# EAGLE design OpenServoCAN_Encoder_Board_V_1_0_1 (EAGLE 9.6.2)
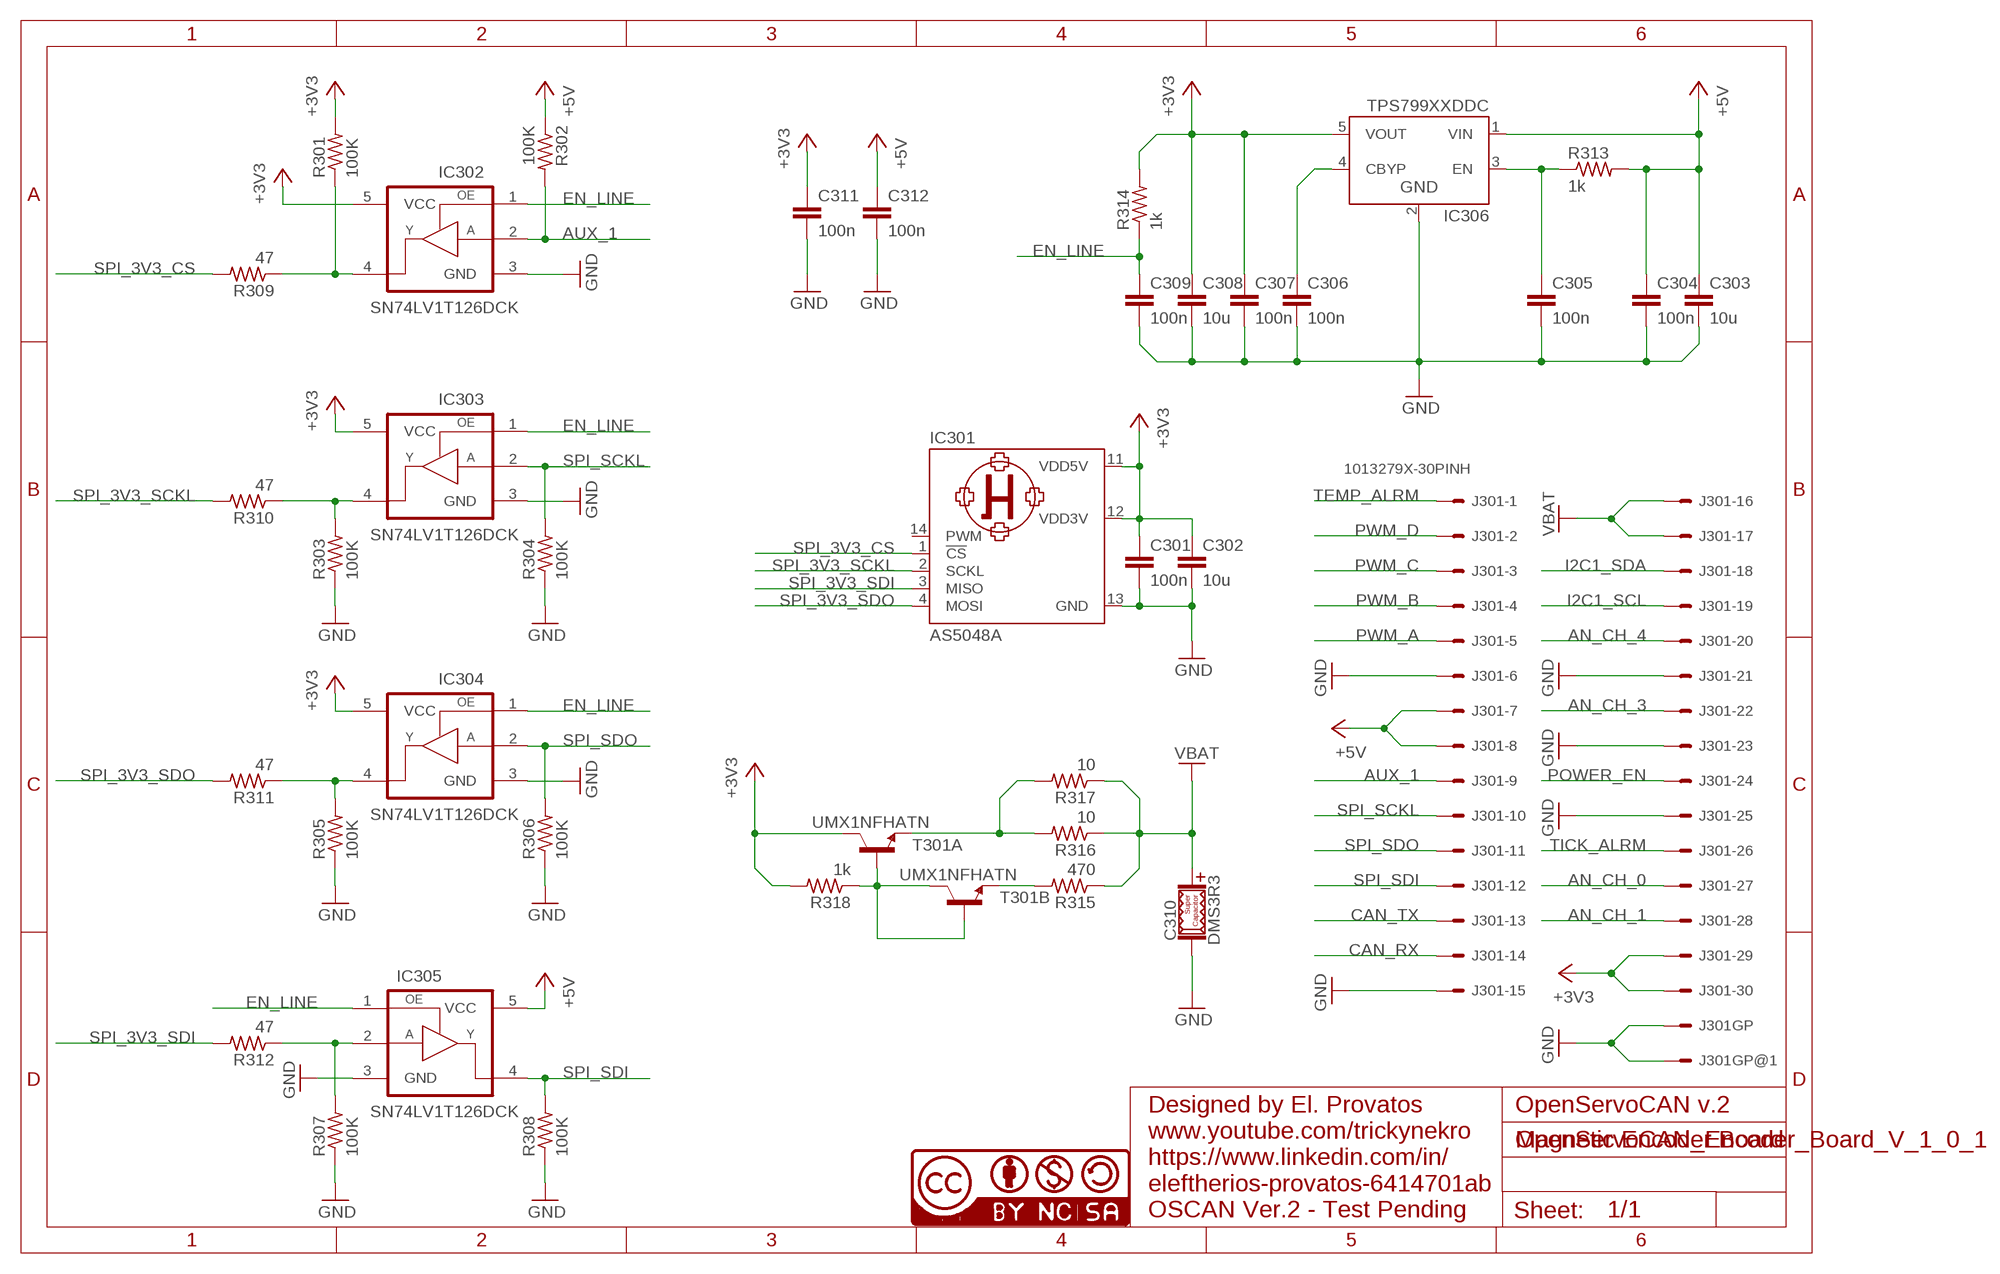
[diagram p0: schematic, sheet 1]

## Parts
C301  100n  C-EUC0402  [0402_C]
C302  10u  C-EUC0402  [0402_C]
C303  10u  C-EUC0402  [0402_C]
C304  100n  C-EUC0402  [0402_C]
C305  100n  C-EUC0402  [0402_C]
C306  100n  C-EUC0402  [0402_C]
C307  100n  C-EUC0402  [0402_C]
C308  10u  C-EUC0402  [0402_C]
C309  100n  C-EUC0402  [0402_C]
C310  DMS3R3  [DMS_3R3_S_CAP]
C311  100n  C-EUC0402  [0402_C]
C312  100n  C-EUC0402  [0402_C]
IC301  AS5048A  [TSSOP-14]
IC302  SN74LV1T126DCK  [SC-70-5]
IC303  SN74LV1T126DCK  [SC-70-5]
IC304  SN74LV1T126DCK  [SC-70-5]
IC305  SN74LV1T126DCK  [SC-70-5]
IC306  TPS799XXDDC  [SOT-23-5]
J301  1013279X-30PINH  [10132797-30]
R301  100K  R-USR0402  [0402_R]
R302  100K  R-USR0402  [0402_R]
R303  100K  R-USR0402  [0402_R]
R304  100K  R-USR0402  [0402_R]
R305  100K  R-USR0402  [0402_R]
R306  100K  R-USR0402  [0402_R]
R307  100K  R-USR0402  [0402_R]
R308  100K  R-USR0402  [0402_R]
R309  47  R-USR0402  [0402_R]
R310  47  R-USR0402  [0402_R]
R311  47  R-USR0402  [0402_R]
R312  47  R-USR0402  [0402_R]
R313  1k  R-USR0402  [0402_R]
R314  1k  R-USR0402  [0402_R]
R315  470  R-USR0402  [0402_R]
R316  10  R-USR0402  [0402_R]
R317  10  R-USR0402  [0402_R]
R318  1k  R-USR0402  [0402_R]
T301  UMX1NFHATN  [SC-70-6]
U$1  CC-NC-BCNIX  [CC-NC-B_NIX]

## Nets
+3V3: C301.1 C302.1 C307.1 C308.1 C311.1 IC301.11(VDD5V) IC301.12(VDD3V) IC302.5(VCC) IC303.5(VCC) IC304.5(VCC) IC306.5(VOUT) J301.29 J301.30 R301.2 R314.2 R318.2 T301.6(A:C)
+5V: C303.1 C304.1 C312.1 IC305.5(VCC) IC306.1(VIN) J301.7 J301.8 R302.1 R313.2
AN_CH_0: J301.27
AN_CH_1: J301.28
AN_CH_3: J301.22
AN_CH_4: J301.20
AUX_1: IC302.2(A) J301.9 R302.2
CAN_RX: J301.14
CAN_TX: J301.13
EN_LINE: C309.1 IC302.1(OE) IC303.1(OE) IC304.1(OE) IC305.1(OE) R314.1
GND: C301.2 C302.2 C303.2 C304.2 C305.2 C306.2 C307.2 C308.2 C309.2 C310.NEG-(NEG) C311.2 C312.2 IC301.13(GND) IC302.3(GND) IC303.3(GND) IC304.3(GND) IC305.3(GND) IC306.2(GND) J301.6 J301.15 J301.21 J301.23 J301.25 J301.EP@2 J301.EP@↑1 R303.1 R304.1 R305.1 R306.1 R307.1 R308.1
I2C1_SCL: J301.19
I2C1_SDA: J301.18
N$2: R318.1 T301.2(A:B) T301.3(B:C) T301.5(B:B)
N$4: C306.1 IC306.4(CBYP)
N$6: R316.2 R317.2 T301.1(A:E)
N$8: IC305.2(A) R307.2 R312.1
N$9: C305.1 IC306.3(EN) R313.1
N$10: IC304.4(Y) R305.2 R311.1
N$11: R315.2 T301.4(B:E)
N$12: IC303.4(Y) R303.2 R310.1
N$13: IC302.4(Y) R301.1 R309.1
POWER_EN: J301.24
PWM_A: J301.5
PWM_B: J301.4
PWM_C: J301.3
PWM_D: J301.2
SPI_3V3_CS: IC301.1(!CS) R309.2
SPI_3V3_SCKL: IC301.2(SCKL) R310.2
SPI_3V3_SDI: IC301.3(MISO) R312.2
SPI_3V3_SDO: IC301.4(MOSI) R311.2
SPI_SCKL: IC303.2(A) J301.10 R304.2
SPI_SDI: IC305.4(Y) J301.12 R308.2
SPI_SDO: IC304.2(A) J301.11 R306.2
TEMP_ALRM: J301.1
TICK_ALRM: J301.26
VBAT: C310.POS+(POS) J301.16 J301.17 R315.1 R316.1 R317.1
Unconnected: IC301.5(TEST) IC301.6(TEST) IC301.7(TEST) IC301.8(TEST) IC301.9(TEST) IC301.10(TEST) IC301.14(PWM)

## Notes on the sheet
- Designed by El. Provatos | OpenServoCAN v.2
- www.youtube.com/trickynekro
- Magnetic Encoder Board
- https://www.linkedin.com/in/
  eleftherios-provatos-6414701ab
- OSCAN Ver.2 - Test Pending

## Library data of the parts
C301-C309 C311 C312 = TRN_Open_Servo:C-EUC: Standard 0402 Capacitor with European Symbol
C310 = TRN_Open_Servo:DMS3R3: DMS 3R3 0.2 - 0.3 F @ 3V3 6.8X1.8 Coin Cell Super Capacitor
IC301 = TRN_Open_Servo:AS5048A: AS5048A The AS5048 is an easy to use 360° angle position sensor with a 14-bit high resolution output. The IC measures the absolute position of the magnet’s rotation angle and consists of Hall sensors, analog digital converter and digital signal processing. The absolute position information of the magnet is directly accessible over a PWM output and can be read out over a standard SPI or a high speed I²C interface. AS5048A has a SPI interface, AS5048B I²C interface. Both devices offer a PWM output. The zero position can be programmed via SPI or I²C command. This simplifies the assembly of the complete system because the zero position of the magnet does not need to be mechanically aligned. The sensor tolerates misalignment, air gap variations, temperature variations and as well external magnetic fields. This robustness and wide temperature range (-40°C up to 150°C) of the AS5048 makes the IC ideal for rotation angle sensing in harsh industrial and medical environments. Several AS5048 ICs can be connected in daisy chain for serial data read out. An internal voltage regulator allows the AS5048 to operate at either 3.3V or 5V supplies.
IC302-IC305 = TRN_Open_Servo:SN74LV1T126: SN74LV1T126 SN74LV1T126 is a low loltage CMOS gate logic that operates at a wider voltage range for industrial, portable, telecom, and automotive applications. The output level is referenced to the supply voltage and is able to support 1.8V/2.5V/3.3V/5V CMOS levels. The input is designed with a lower threshold circuit to match 1.8V input logic at VCC = 2.5V and can be used in 1.8V to 3.3V level up translation. In addition, the 5V tolerant input pins enable down translation (e.g. 3.3V to 2.5V output at VCC = 2.5V). The wide VCC range of 1.8V to 5.5V allows generation of desired output levels to connect to controllers or processors. The SN74LV1T126 is designed with current-drive capability of 8mA to reduce line reflections, overshoot, and undershoot caused by high-drive putputs.
IC306 = TRN_Open_Servo:TPS799XX: TPS799XX The TPS799 family of low-cost (LDO), low-power linear regulators offers excellent ac performance with very low ground currect. High power-supply rejection ration (PSRR), low noise, fast start-up, and excellent line and load transient response are provided while consuming a very low 40-μA (typical) ground current. The TPS799 is stable with ceramic capacitors and uses an advanced BiCMOS fabrication process to yield a dropout voltage of typically 100mV at a 200-mA output. The TPS799 uses a precision voltage reference and feedback loop to achieve an overall accuracy of 2% over all load, line, process, and temperature variations. The TPS799 features inrush current protection when the EN toggle is used to start the device, immediately clamping the current. All devices are fully specified over the temperature range of TJ = -10°C to 125°C, and offered in a low-profile, die-sided ball grid array (DSBGA) package, ideal for wireless handsets and WLAN cards. Link to Datasheet <https://www.ti.com/lit/ds/symlink/tps799.pdf?ts=1598828159184>
J301 = arm_project:1013279X-30PIN: Amphenol BergStak® 0.5mm Mezzanine Connector 20 Pin Variant Header / Receptacle
R301-R318 = TRN_Open_Servo:R-USR: Standard 0402 Resistor with American Symbol
T301 = TRN_Open_Servo:UMX1NFHA: UMX1NFHA General Purpose Transistor (Dual Transistors)
U$1 = cc-by-nc-sa:CC-NC-BC: All hardware is licensed under the Creative Commons Attribution-Noncommercial-Share Alike 2.5 Switzerland License. To view a copy of this license, visit http://creativecommons.org/licenses/by-nc-sa/2.5/ch/ or send a letter to Creative Commons, 171 Second Street, Suite 300, San Francisco, California, 94105, USA.

## Board
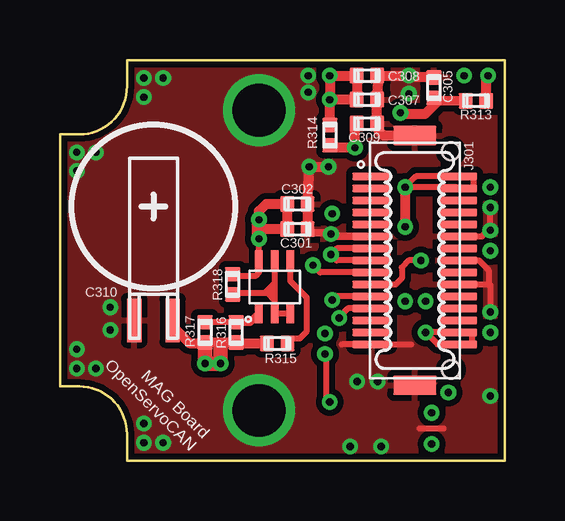
[diagram p1: board, top side]
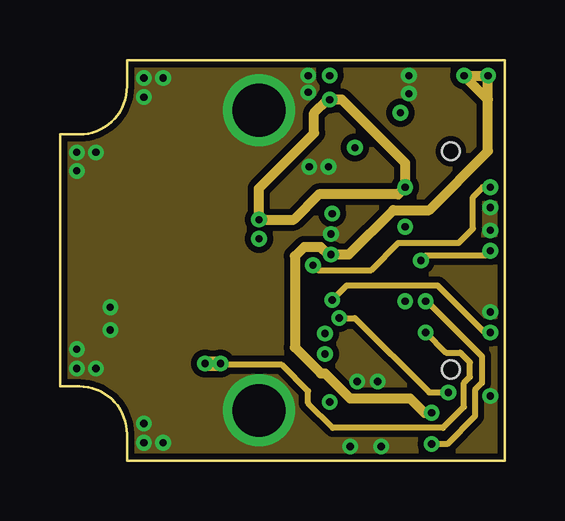
[diagram p2: board, inner layer Route2]
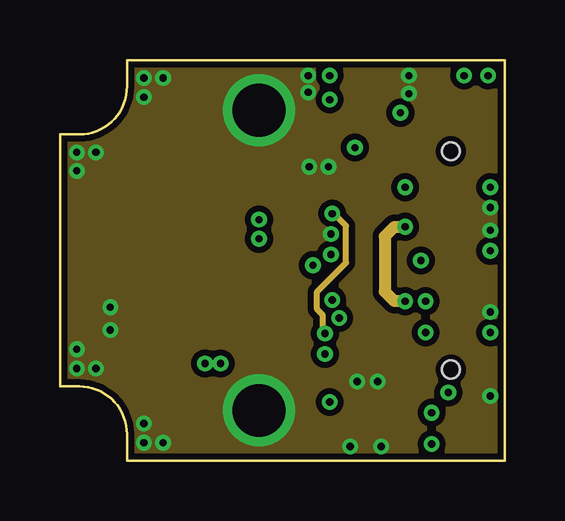
[diagram p3: board, inner layer Route15]
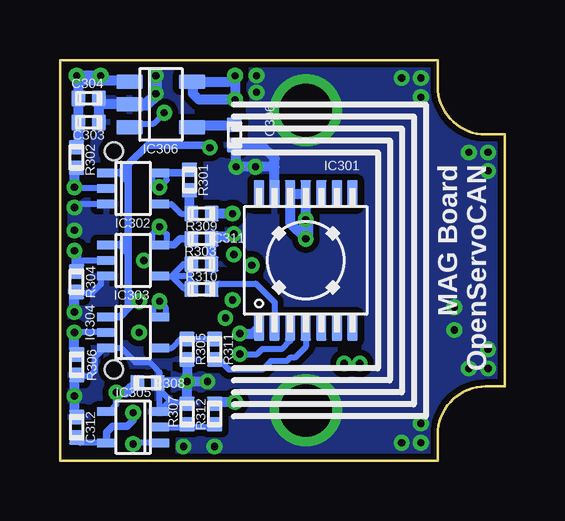
[diagram p4: board, bottom side, seen from below]

Size 18.55 x 16.7 mm. Coordinates in mm from the lower left corner, seen from the top.
Outline: 18.55,16.7 18.55,0 2.8,0 2.8,1.1 arc90 0.8,3.1 0,3.1 0,13.6 0.8,13.6 arc90 2.8,15.6 2.8,16.7 18.55,16.7
Copper layers (1+2*15+16): Top 0.018mm / dielectric 0.2mm / Route2 0.035mm / dielectric 0.36mm / Route15 0.035mm / dielectric 0.2mm / Bottom 0.018mm
Design rules "default *": minimum track width 6mil, minimum drill 0.3mm, track to track 6mil, track to pad 6mil, pad to pad 6mil, via to via 6mil, smd to smd 6mil, copper to edge 8mil, drill to drill 6mil, minimum pad ring 10mil, minimum via ring 5mil, stop-mask expansion 3mil, vias tented up to drill 15mil, thermal gap 10mil
tKeepout: area 6.3,12.6 to 10.3,16.6; area 6.3,0.1 to 10.3,4.1
bKeepout: area 6.3,12.6 to 10.3,16.6; area 6.3,0.1 to 10.3,4.1

### Footprints (pad centres in the part's own frame; a part is rotated, then mirrored left to right if it is on the bottom)
0402_C = smd 0.6 x 0.65: 1 -0.425,0; 2 0.425,0
DMS_3R3_S_CAP = smd 1.8 x 0.6: NEG- 4.75,-0.8; POS+ 4.75,0.8
TSSOP-14 = smd 1.15 x 0.45: 1 -2.775,1.95; 2 -2.775,1.3; 3 -2.775,0.65; 4 -2.775,0; 5 -2.775,-0.65; 6 -2.775,-1.3; 7 -2.775,-1.95; 8 2.775,-1.95; 9 2.775,-1.3; 10 2.775,-0.65; 11 2.775,0; 12 2.775,0.65; 13 2.775,1.3; 14 2.775,1.95
SC-70-5 = smd 0.35 x 0.85: 1 -0.65,-1.1; 2 0,-1.1; 3 0.65,-1.1; 4 0.65,1.1; 5 -0.65,1.1
SOT-23-5 = smd 0.6 x 1.1: 1 -0.95,-1.3; 2 0,-1.3; 3 0.95,-1.3; 4 0.95,1.3; 5 -0.95,1.3
10132797-30 = smd 1.6 x 0.3: 1 -1.8,3.5; 2 -1.8,3; 3 -1.8,2.5; 4 -1.8,2; 5 -1.8,1.5; 6 -1.8,1; 7 -1.8,0.5; 8 -1.8,0; 9 -1.8,-0.5; 10 -1.8,-1; 11 -1.8,-1.5; 12 -1.8,-2; 13 -1.8,-2.5; 14 -1.8,-3; 15 -1.8,-3.5; 16 1.8,-3.5; 17 1.8,-3; 18 1.8,-2.5; 19 1.8,-2; 20 1.8,-1.5; 21 1.8,-1; 22 1.8,-0.5; 23 1.8,0; 24 1.8,0.5; 25 1.8,1; 26 1.8,1.5; 27 1.8,2; 28 1.8,2.5; 29 1.8,3; 30 1.8,3.5 | smd 1.8 x 0.8: EP@2 0,-5.2; EP@↑1 0,5.2 | hole 0.75: 1.5,-4.55; 1.5,4.55
0402_R = smd 0.6 x 0.65: 1 -0.425,0; 2 0.425,0
SC-70-6 = smd 0.85 x 0.35: 1 -1.1,0.65; 2 -1.1,0; 3 -1.1,-0.65; 4 1.1,-0.65; 5 1.1,0; 6 1.1,0.65

### Placement (x,y rotation side)
C301  9.9,9.65 0 top
C302  9.9,10.7 0 top
C303  17.35,14.1 0 bottom
C304  17.35,15.1 0 bottom
C305  15.6,15.55 90 top
C306  11.27,13.58 270 bottom
C307  12.8,15.05 0 top
C308  12.8,16.05 0 top
C309  12.8,14.05 0 top
C310  3.9,10.6 270 top
C311  12.65,9.25 0 bottom
C312  17.85,1.4 90 bottom
IC301  8.3,8.35 90 bottom
IC302  15.5,11.35 270 bottom
IC303  15.5,8.35 270 bottom
IC304  15.5,5.35 270 bottom
IC305  15.5,1.4 90 bottom
IC306  14.34,14.85 270 bottom
J301  14.8,8.35 0 top
R301  13.15,11.7 90 bottom
R302  17.86,12.64 270 bottom
R303  12.65,8.2 180 bottom
R304  17.86,7.46 90 bottom
R305  13.25,4.65 90 bottom
R306  17.85,4 90 bottom
R307  13.25,1.95 270 bottom
R308  14.9,3.25 180 bottom
R309  12.65,10.3 0 bottom
R310  12.65,7.15 0 bottom
R311  12.1,4.65 270 bottom
R312  12.1,1.95 90 bottom
R313  17.35,15 0 top
R314  11.26,13.57 90 top
R315  9.06,4.89 0 top
R316  7.35,5.35 90 top
R317  6.05,5.35 90 top
R318  7.2,7.35 90 top
T301  8.95,7.25 90 top
U$1  -0.35,-0.45 0 top

### Tracks (layer width: path | path; a pad name or v marks a point on that pad's centre or on a via)
+3V3  (via drill 0.3 pad 0.65)
  Top 0.254: R318.2 7.35,7.7 8.15,7.7 8.3,7.85 T301.6 v8.3,9.25 | J301.29 16.55,11.4 v14.4,11.4 14.85,11.85 J301.30 17.25,11.85 17.25,11.35 J301.29
  Top 0.406: v11.25,15.05 C307.1 C308.1 v11.25,16.05 v11.25,15.05 | R314.2 11.25,14.08 v11.25,15.05 | v8.3,9.25 8.3,9.65 C301.1 C302.1 8.6,10.7 8.3,10.4 v8.3,10.05 | v14.4,9.75 v14.4,11.4
  Top 0.61: v8.3,9.25 v8.3,10.05
  Route2 0.406: v14.4,11.4 14.4,12.4 11.75,15.05 v11.25,15.05 11.15,15.05 10.6,14.5 10.6,13.65 8.3,11.35 v8.3,10.05 9.75,10.05 10.8,11.1 14.1,11.1 v14.4,11.4
  Route15 0.508: v14.4,6.65 13.95,6.65 13.55,7.05 13.55,9.35 13.95,9.75 v14.4,9.75
  Bottom 0.254: 8.3,11.1 IC301.11 | IC301.12 8.93,11.1 | IC302.5 14.1,12 14.1,11.7 v14.4,11.4 14.7,11.7 14.7,11.9 14.6,12 IC302.5 | v14.4,9.75 14.7,9.45 14.7,9.05 14.65,9 IC303.5 14.1,9 14.1,9.45 v14.4,9.75 | v14.4,6.65 14.15,6.4 14.15,6 14.5,6 14.65,6 14.65,6.4 v14.4,6.65
  Bottom 0.305: 14.1,9 13.8,9 13.55,9.25 C311.1 | IC304.5 14.5,6 | IC302.5 13.28,12 R301.2
  Bottom 0.406: IC306.5 13,15.8 | 13,15.8 11.5,15.8 v11.25,16.05 v11.25,15.05 12.75,15.05 13,15.3 13,15.8 | v8.3,10.05 8.3,11.1 8.95,11.1 | IC301.12 8.95,11.1 | 8.95,11.1 8.95,9.9 v8.3,9.25
  Bottom 0.61: v8.3,9.25 v8.3,10.05
+5V  (via drill 0.3 pad 0.65)
  Top 0.254: J301.7 11.56,8.85 11.55,8.84 11.54,8.84 v11.3,8.6 11.55,8.35 J301.8 13.65,8.35 13.65,8.85 J301.7
  Top 0.406: R313.2 17.78,15.97 v17.85,16.05
  Route2 0.406: 17.85,15.05 17.85,12.9 15.4,10.45 13.9,10.45 12.05,8.6 v11.3,8.6 11.18,8.6 10.87,8.91 10.18,8.91 9.8,8.53 9.8,4.72 10.88,3.64 11.06,3.64 12.1,2.6 14.6,2.6 15.2,2 v15.5,2 | 17.85,15.05 v17.85,16.05 v16.85,16.05 17.85,15.05
  Bottom 0.254: IC305.5 17.7,0.75 C312.1
  Bottom 0.305: IC305.5 16.6,1.2 16.35,1.45 15.75,1.45 15.5,1.7 v15.5,2
  Bottom 0.406: 16.66,15.86 17.6,15.86 17.75,15.7 17.75,15.95 v17.85,16.05 | 16.66,15.86 15.7,15.86 IC306.1 | 17.85,13.15 R302.1 17.78,13.15 C303.1 C304.1 17.78,15.97 v17.85,16.05 | v17.85,16.05 v16.85,16.05 16.66,15.86
AUX_1  (via drill 0.3 pad 0.65)
  Top 0.254: J301.9 10.85,7.85 v10.55,8.15
  Route2 0.254: v10.55,8.15 10.75,7.95 12.98,7.95 14.11,9.08 16.63,9.08 17.22,9.67 17.22,10.99 17.63,11.4 v17.95,11.4
  Bottom 0.254: IC302.2 17.9,11.35 v17.95,11.4
  Bottom 0.406: R302.2 17.95,12.05 v17.95,11.4
EN_LINE  (via drill 0.3 pad 0.65)
  Top 0.406: v12.3,13.05 12.28,13.07 | v12.3,13.05 12.3,13.97 C309.1 | v12.3,13.05 11.36,13.05 R314.1
  Route2 0.254: v15.25,6.65 15.3,6.65 17.6,4.35 17.6,3.25 17.31,2.96 17.31,1.86 16.15,0.7 v15.5,0.7
  Bottom 0.254: v15.5,0.7 15.45,0.75 IC305.1
  Bottom 0.305: v12.3,13.05 12.4,13.15 14.9,13.15 15.7,12.35 | IC302.1 16.05,12 | 15.7,12.35 16.05,12 | 15.7,12.35 15.7,11.65 | 15.7,11.65 15.7,9.35 | 15.7,9.35 15.7,8.65 | IC303.1 16.05,9 | 16.05,12 15.7,11.65 | 16.05,9 15.7,9.35 | 16.05,9 15.7,8.65 | v15.25,6.65 15.7,6.65 | 15.7,8.65 15.7,7.05 | 15.7,7.05 15.7,6.65 | 15.7,6.65 15.7,6.35 | IC304.1 16.05,6 15.7,6.35 | v15.25,6.65 15.4,6.65 15.7,6.35 | v15.25,6.65 15.3,6.65 15.7,7.05
GND  (via drill 0.3 pad 0.65, 2.2 pad 3)
  Top 0.254: J301.25 17.6,9.35 17.95,9.7 v17.95,10.55 | J301.21 17.8,7.35 17.85,7.4 17.88,7.37 | 17.88,7.37 17.95,7.3 v17.95,6.2 | 17.88,7.37 17.88,7.94 17.47,8.35 J301.23 | 14.65,4.85 J301.15 11.75,4.85 | 15,1.35 16,1.35
  Top 0.305: J301.6 11.4,9.35 v11.3,9.45 11.25,9.5 10.55,9.5 C301.2
  Top 0.406: v14.56,16.04 v14.55,16.05 | C308.2 13.31,16.04 | 13.31,16.04 v14.56,16.04 | 13.31,16.04 13.3,16.03 C307.2 C309.2 13.3,13.75 13.5,13.55 J301.EP@↑1 | C301.2 C302.2 v10.4,12.25 v11.2,12.25 | C305.2 14.62,15.97 v14.56,16.04
  Bottom 0.254: R307.1 13.9,2.46 | 13.9,2.46 13.99,2.46 IC305.3 14.4,2.96 | 14.4,3.15 R308.1 14.4,3.7 14.8,4.1 15.4,4.1 16.01,4.71 IC304.3 16.7,4.7 17.1,4.3 17.1,3.75 17.35,3.5 R306.1 | 14.4,3.15 14.4,2.96 | 14.4,2.96 13.9,2.46 | 14.3,3.25 14.4,3.15 | R304.1 17.24,6.96 16.85,7.35 16.85,7.6 16.75,7.7 IC303.3 | IC302.3 17.8,10.7 v17.95,10.55
  Bottom 0.406: R306.1 17.95,3.4 v17.95,2.7 17.95,2 C312.2 | R305.1 v13.25,3.3 | R308.1 14.35,3.3 v13.25,3.3 | R307.1 v13.25,3.3 | v12.4,3.3 v13.25,3.3 | IC306.2 16.85,14.85 C304.2 C303.2 | v17.95,6.2 17.95,6.87 R304.1 | IC301.13 9.6,12.25 | 9.6,12.25 v10.4,12.25 v11.2,12.25 11.2,13.01 C306.2 | 9.6,12.25 9.6,12.6 10.05,13.05 11.25,13.05 | R303.1 C311.2 12.05,9.35 11.4,9.35 v11.3,9.45
  Bottom 0.508: IC306.2 14.95,14.85 14.55,15.25 v14.55,15.3 v14.55,16.05
  other vias: 2.1,5.45 0.7,4.65 2.1,6.4 1.5,3.85 8.3,14.6 8.3,2.1 17.95,9.6 13.4,0.6 12.1,0.6 3.5,0.75 4.3,0.75 3.5,1.55 0.7,3.85 0.7,12.85 1.5,12.85 0.7,12.08 3.5,15.95 4.3,15.95 3.5,15.15 10.35,16.05 10.35,15.35
  pour Top (isolate 0.254): -0.2,8.35 -0.2,-0.15 18.8,-0.15 18.8,16.85 -0.2,16.85
  pour Route2 (isolate 0.254): -0.2,16.85 18.8,16.85 18.8,-0.15 -0.2,-0.15
  pour Route15 (isolate 0.254): -0.2,16.85 18.8,16.85 18.8,-0.15 -0.2,-0.15
  pour Bottom (isolate 0.254): -0.2,16.85 18.8,16.85 18.8,-0.15 -0.2,-0.15
N$2
  Top 0.254: T301.3 T301.2 8.95,6.7 | R318.1 7.35,7 8.65,7 | 8.6,7.05 8.8,7.05 8.95,6.9 | 8.95,6.9 8.95,6.7 | T301.5 8.95,7.4 | 8.95,7.4 8.95,6.9 | 8.6,7.05 8.95,7.4 | 8.6,7.05 8.65,7 | 8.65,7 8.95,6.7
N$4
  Bottom 0.406: C306.1 11.37,13.98 12.96,13.98 IC306.4
N$6
  Top 0.254: R316.2 R317.2
  Top 0.305: R316.2 7.92,5.77 T301.1
N$8
  Bottom 0.254: IC305.2 13.3,1.4 R307.2 13.19,1.41 12.14,1.41 R312.1
N$9  (via drill 0.3 pad 0.65)
  Top 0.406: R313.1 15.75,14.99 | 15.75,14.99 15.67,14.99 C305.1 | v14.2,14.5 14.25,14.45 15.21,14.45 15.75,14.99
  Bottom 0.254: IC306.3 15.49,14.05 14.65,14.05 v14.2,14.5
N$10
  Bottom 0.254: R311.1 R305.2 13.45,5.15 13.9,4.7 IC304.4
N$11
  Top 0.254: R315.2 9.56,5.09 9.99,5.09 10.3,5.4 10.3,6.8 9.6,7.5 T301.4
N$12
  Bottom 0.254: R310.1 13.15,7.2 | 13.15,7.2 13.15,7.75 | 13.15,7.75 R303.2 13.4,8.2 13.9,7.7 | IC303.4 13.9,7.7 | 13.9,7.7 13.2,7.7 13.15,7.75 | 13.9,7.7 13.4,7.2 13.15,7.2
N$13
  Bottom 0.254: IC302.4 13.9,10.7 13.5,10.3 R309.1
  Bottom 0.406: R309.1 13.15,10.38 R301.1
SPI_3V3_CS  (via drill 0.3 pad 0.65)
  Route15 0.254: v11.05,5.3 10.95,5.4 10.95,6.08 10.72,6.31 10.72,7.05 11.93,8.26 11.93,9.79 11.42,10.3 v11.35,10.3
  Bottom 0.406: v11.05,5.3 10.53,5.3 IC301.1 | v11.35,10.3 R309.2
SPI_3V3_SCKL
  Bottom 0.254: R310.2 11.92,7.38 10.38,7.38 9.6,6.6 IC301.2
SPI_3V3_SDI  (via drill 0.3 pad 0.65)
  Top 0.254: v11.05,4.45 11.1,4.4 11.1,2.45 v11.25,2.45
  Bottom 0.254: 12.09,2.44 R312.2 | IC301.3 8.95,5 9.29,4.66 10.12,4.66 10.33,4.45 v11.05,4.45
  Bottom 0.406: v11.25,2.45 12.09,2.45 12.09,2.44
SPI_3V3_SDO
  Bottom 0.254: IC301.4 8.3,4.75 8.75,4.3 8.95,4.3 9.1,4.15 9.75,4.15 10.1,3.8 11.5,3.8 11.85,4.15 R311.2
SPI_SCKL  (via drill 0.3 pad 0.65)
  Top 0.254: J301.10 14,7.35 14.25,7.6 14.25,8.05 14.55,8.35 v15.05,8.35
  Route2 0.254: v15.05,8.35 15.25,8.55 17.75,8.55 v17.95,8.75
  Bottom 0.254: 17.86,8.35 17.7,8.35 17.86,8.51 | IC303.2 17.65,8.35 17.65,8.17 R304.2
  Bottom 0.406: R304.2 17.86,8.35 17.86,8.51 17.86,8.66 v17.95,8.75
SPI_SDI  (via drill 0.3 pad 0.65)
  Top 0.254: J301.12 12,6.35 11.65,6 v11.65,5.95
  Route2 0.254: v11.65,5.95 12.3,5.95 15.4,2.85 v16.2,2.85
  Bottom 0.254: IC305.4 16.5,2.05 16.2,2.35 v16.2,2.85
  Bottom 0.406: R308.2 15.79,2.85 v16.2,2.85
SPI_SDO  (via drill 0.3 pad 0.65)
  Top 0.254: J301.11 11.5,6.85 v11.35,6.7
  Route2 0.254: v17.95,5.35 17.7,5.35 15.75,7.3 11.95,7.3 v11.35,6.7
  Bottom 0.254: IC304.2 v17.95,5.35
  Bottom 0.406: R306.2 17.95,4.6 v17.95,5.35
VBAT  (via drill 0.3 pad 0.65)
  Top 0.254: J301.17 v15.25,5.35 15.75,4.85 J301.16 17.2,4.85 17.2,5.35 J301.17
  Top 0.305: C310.POS+ 4.7,5.6
  Top 0.406: R317.1 R316.1 7.38,4.89 R315.1 | R317.1 6.01,4.88 | 4.7,5.15 C310.POS+ 4.7,6.4 | 4.7,5.6 5.4,4.9 6.02,4.9 R317.1
  Top 0.61: 6.7,4.75 v6.7,4.05 v6.05,4.05 R317.1
  Route2 0.254: v15.25,5.35 16.1,4.5 16.69,4.5 17.1,4.1 17.1,3.5 16.85,3.25 16.85,2.25 15.97,1.37 11.38,1.37 10.35,2.4 10.35,2.9 9.25,4 6.75,4 v6.7,4.05
  Route2 0.61: v6.05,4.05 v6.7,4.05

### Text on the board
bPlace: MAG Board / OpenServoCAN
tNames: MAG Board / OpenServoCAN
tStop: El. / Pro.
bStop: El. / Pro.